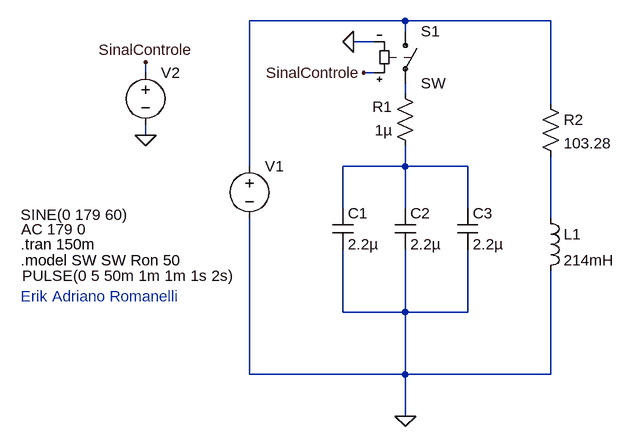
[diagram p0: schematic SimTCC_Final_transitorio.asc]
SimTCC_Final_transitorio.asc, the LTspice schematic file:
Version 4
SHEET 1 880 680
WIRE 336 -192 96 -192
WIRE 560 -192 336 -192
WIRE 336 -176 336 -192
WIRE 288 -160 256 -160
WIRE -64 -112 -64 -128
WIRE 288 -112 272 -112
WIRE 336 -80 336 -96
WIRE 560 -64 560 -192
WIRE -64 -16 -64 -32
WIRE 96 32 96 -192
WIRE 336 32 336 0
WIRE 336 32 240 32
WIRE 432 32 336 32
WIRE 240 96 240 32
WIRE 336 96 336 32
WIRE 432 96 432 32
WIRE 560 112 560 16
WIRE 240 256 240 160
WIRE 336 256 336 160
WIRE 336 256 240 256
WIRE 432 256 432 160
WIRE 432 256 336 256
WIRE 96 352 96 112
WIRE 336 352 336 256
WIRE 336 352 96 352
WIRE 560 352 560 192
WIRE 560 352 336 352
WIRE 336 416 336 352
FLAG 256 -160 0
FLAG 272 -112 SinalControle
FLAG -64 -128 SinalControle
FLAG -64 -16 0
FLAG 336 416 0
SYMBOL voltage 96 16 R0
WINDOW 3 -352 90 Left 2
WINDOW 123 -351 113 Left 2
WINDOW 39 0 0 Left 0
SYMATTR Value SINE(0 179 60)
SYMATTR Value2 AC 179 0
SYMATTR InstName V1
SYMBOL cap 224 96 R0
SYMATTR InstName C1
SYMATTR Value 2.2µ
SYMBOL cap 320 96 R0
SYMATTR InstName C2
SYMATTR Value 2.2µ
SYMBOL cap 416 96 R0
SYMATTR InstName C3
SYMATTR Value 2.2µ
SYMBOL res 352 16 R180
WINDOW 0 36 76 Left 2
WINDOW 3 36 40 Left 2
SYMATTR InstName R1
SYMATTR Value 1µ
SYMBOL res 544 -80 R0
SYMATTR InstName R2
SYMATTR Value 103.28
SYMBOL ind 544 96 R0
SYMATTR InstName L1
SYMATTR Value 214mH
SYMBOL voltage -64 -128 R0
WINDOW 3 -190 328 Left 2
WINDOW 123 0 0 Left 0
WINDOW 39 0 0 Left 0
SYMATTR Value PULSE(0 5 50m 1m 1m 1s 2s)
SYMATTR InstName V2
SYMBOL sw 336 -192 R0
SYMATTR InstName S1
TEXT -256 152 Left 2 !.tran 150m
TEXT -256 176 Left 2 !.model SW SW Ron 50
TEXT -256 232 Left 2 ;Erik Adriano Romanelli

The netlist it stands for:
* SimTCC_Final_transitorio.asc
V1 N001 0 SINE(0 179 60) AC 179 0
C1 N003 0 2.2µ
C2 N003 0 2.2µ
C3 N003 0 2.2µ
R1 N003 N002 1µ
R2 N001 N004 103.28
L1 N004 0 214mH
V2 SinalControle 0 PULSE(0 5 50m 1m 1m 1s 2s)
S1 N001 N002 SinalControle 0 SW
.tran 150m
.model SW SW Ron 50
* Erik Adriano Romanelli
.backanno
.end